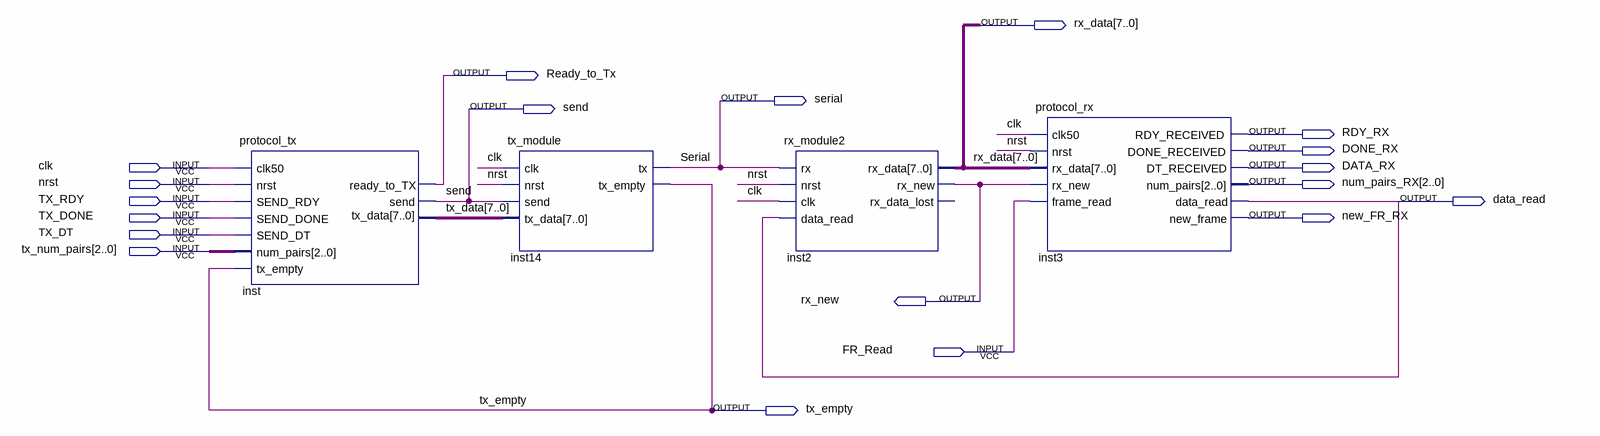
[diagram p0: schematic sheet]
// Quartus schematic communication_sim.bdf as structural Verilog: 4 symbols, 19 pins
module communication_sim (
  input  clk,
  input  nrst,
  input  TX_RDY,
  input  TX_DONE,
  input  TX_DT,
  input  [2:0] tx_num_pairs,
  input  FR_Read,
  output [7:0] rx_data,
  output Ready_to_Tx,
  output serial,
  output send,
  output RDY_RX,
  output DONE_RX,
  output DATA_RX,
  output [2:0] num_pairs_RX,
  output data_read,
  output new_FR_RX,
  output rx_new,
  output tx_empty
);

  wire [7:0] tx_data;

  protocol_tx inst (
    .clk50(clk), .nrst(nrst), .SEND_RDY(TX_RDY), .SEND_DONE(TX_DONE), .SEND_DT(TX_DT),
    .num_pairs(tx_num_pairs), .tx_empty(tx_empty), .tx_data(tx_data), .ready_to_TX(Ready_to_Tx), .send(send));
  tx_module inst14 (.clk(clk), .nrst(nrst), .send(send), .tx_data(tx_data), .tx(serial), .tx_empty(tx_empty));
  rx_module2 inst2 (
    .clk(clk), .nrst(nrst), .rx(serial), .data_read(data_read), .rx_data(rx_data), .rx_new(rx_new));  // open: rx_data_lost
  protocol_rx inst3 (
    .clk50(clk), .nrst(nrst), .rx_data(rx_data), .rx_new(rx_new), .frame_read(FR_Read),
    .RDY_RECEIVED(RDY_RX), .DONE_RECEIVED(DONE_RX), .DT_RECEIVED(DATA_RX), .num_pairs(num_pairs_RX),
    .data_read(data_read), .new_frame(new_FR_RX));
endmodule
